# Altium schematic sheet 1_P1.schdoc
size 307 x 218 mm; Symbol: Drawing-Symbol_A4; Device: Drawing-Symbol_A4; Company: 嘉立创EDA; Version: V1.0; Page Size: A4; @Project Name: 25国赛; @Page Count: 1; @Update Date: 2025-08-02; @Create Date: 2025-07-29; @Schematic Name: Schematic1; @Page No: 1; @Page Name: P1; @Create Time: 21:32:43; @Update Time: 02:34:49; Width: 1170; Height: 825; Region Start: 1; X Region Count: 6; Y Region Count: 4; Blade Width: 10; Title Block Position: 3; @Board Name: 滤波器
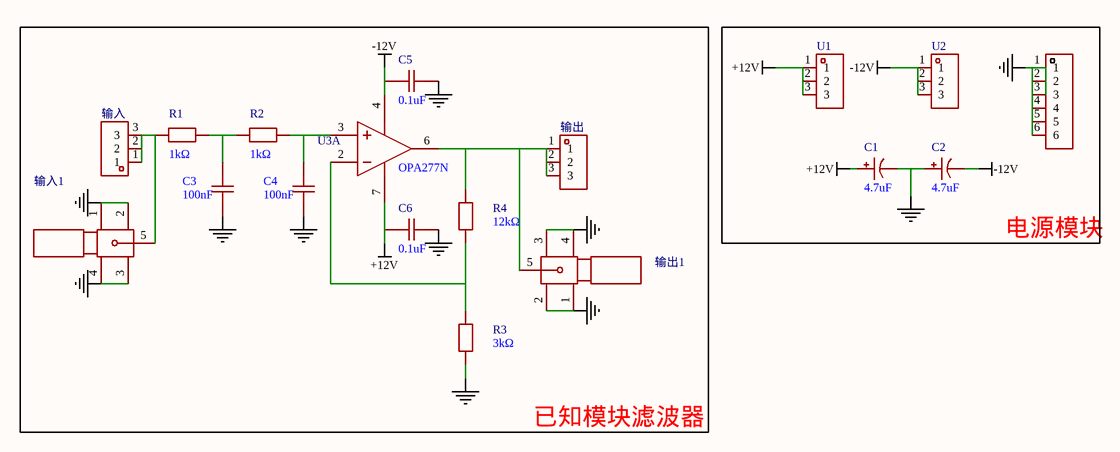
[diagram p0: 1_P1.schdoc]

## Parts
C1  4.7uF  [C0805]
C2  4.7uF  [C0805]
C3  100nF  [C0805]
C4  100nF  [C0805]
C5  0.1uF  [C0805]
C6  0.1uF  [C0805]
H6  PZ254V-11-06P  [HDR-TH_6P-P2.54-V-M]  (value not drawn)
R1  1kΩ  [R0805]
R2  1kΩ  [R0805]
R3  3kΩ  [R0805]
R4  12kΩ  [R0805]
U1  PZ254V-11-03P  [HDR-TH_3P-P2.54-V-M]  (value not drawn)
U2  PZ254V-11-03P  [HDR-TH_3P-P2.54-V-M]  (value not drawn)
U3  OPA277N  [PDIP-8_L9.6-W6.4-P2.54-LS7.6-BL]  (part A of 2)
输入  PZ254V-11-03P  [HDR-TH_3P-P2.54-V-M]  (value not drawn)
输入1  BWSMA-KWE-Z001  [SMA-TH_BWSMA-KWE-Z001]  (value not drawn)
输出  PZ254V-11-03P  [HDR-TH_3P-P2.54-V-M]  (value not drawn)
输出1  BWSMA-KWE-Z001  [SMA-TH_BWSMA-KWE-Z001]  (value not drawn)

## Blocks framed on the sheet
已知模块滤波器: C3-C6 R1-R4 U3 输入 输入1 输出 输出1
电源模块: C1 C2 H6 U1 U2

## Nets
+12V: C1.1 C6.2 U1.1 U1.2 U1.3 U3.7(V+)
-12V: C2.2 C5.2 U2.1 U2.2 U2.3 U3.4(V-)
GND: C1.2 C2.1 C3.1 C4.1 C5.1 C6.1 H6.1 H6.2 H6.3 H6.4 H6.5 H6.6 R3.2 输入1.1 输入1.2 输入1.3 输入1.4 输出1.1 输出1.2 输出1.3 输出1.4
NetC3_2: C3.2 R1.1 R2.2
NetC4_2: C4.2 R2.1 U3.3(IN+)
NetR1_2: R1.2 输入.1 输入.2 输入.3 输入1.5
NetR3_1: R3.1 R4.2 U3.2(IN-)
NetR4_1: R4.1 U3.6(OUT) 输出.1 输出.2 输出.3 输出1.5

## Notes on the sheet
- 1
- 2
- 3
- 4
- 5
- 6
- A
- B
- C
- 原理图
- Schematic1
- 创建日期
- 更新日期
- 2025-07-29
- 2025-08-02
- 板子
- 绘制
- 滤波器
- 图页
- P1
- D
- 审阅
- 版本
- 尺寸
- 25国赛
- 页    1    共    1
- V1.0
- A4
- 嘉立创EDA

## Library data of the parts
C1 C2 = ERS1HM4R7D11OT: Manufacturer: AISHI(艾华集团); Add into BOM: yes; Tolerance: ±20%; Rated Voltage: 50V; φD: 5mm; L: 11mm; Lifetime @ Temp: 5000hrs@105℃; Symbol: ERS1HM4R7D11OT; Device: ERS1HM4R7D11OT; Supplier: LCSC; Manufacturer Part: ERS1HM4R7D11OT; Value: 4.7uF; Supplier Part: C112512; JLCPCB Part Class: 扩展库; LCSC Part Name: 4.7uF ±20% 50V; Supplier Footprint: 插件,D5xL11mm; Datasheet: https://atta.szlcsc.com/upload/public/pdf/source/20191015/C438940_4B8E60A742BB0AE40DDEF87A5C89089D.pdf; Convert to PCB: yes; Lead Spacing: 2mm
C3 C4 = CAP_0603: Symbol: Capacitance; Convert to PCB: yes; Device: CAP_0603; Add into BOM: yes; Supplier Footprint: 0603; Value: 100nF
C5 C6 = R08B1B102KN0B0S0N0: Manufacturer: STE(松田); Add into BOM: yes; Tolerance: ±10%; Voltage Rated: 2kV; Temperature Coefficient: Y5P; φD: 8mm; Body Thickness: 3mm; Symbol: R08B1B102KN0B0S0N0; Device: R08B1B102KN0B0S0N0; LCSC Part Name: 1nF ±10% 2kV; Manufacturer Part: R08B1B102KN0B0S0N0; Supplier Footprint: 插件,P=5mm; JLCPCB Part Class: 扩展库; Datasheet: https://atta.szlcsc.com/upload/public/pdf/source/20190806/C366874_7FA13009B587FE73099181E533DD7411.pdf; Supplier: LCSC; Convert to PCB: yes; Value: 0.1uF; Lead Spacing: 5mm
H6 = PZ254V-11-06P: Manufacturer: XFCN(兴飞); Add into BOM: yes; Pin Structure: 1x6P; Pitch: 2.54mm; Circluar Pins/Square Pins: 方针; Symbol: PZ254V-11-06P; Device: PZ254V-11-06P; LCSC Part Name: 1x6P 间距:2.54mm 方针 直插; Supplier Part: C492405; Manufacturer Part: PZ254V-11-06P; Supplier Footprint: 插件,P=2.54mm; JLCPCB Part Class: 扩展库; Datasheet: https://atta.szlcsc.com/upload/public/pdf/source/20200309/C492405_597F1930F5B55CC3C7FD95458F1C3977.pdf; Supplier: LCSC; Convert to PCB: yes; Row Spacing: -; Mounting Type: 直插; Number of Rows: 单排; Number of Pins: 6P; Current Rating: -; Voltage Rating (Max): -; Length of Mating Pin: 6mm; Insulation Height: 2.5mm; Length of End Connection Pin: 3mm; Contact Material: 黄铜; Contact Plating: -; Operating Temperature: -40℃~+105℃; Color: 黑色
R1-R4 = MF1/4W-1K±1%-ST52: Manufacturer: VO(翔胜); Add into BOM: yes; Tolerance: ±1%; Overload Voltage (Max): 250V; Power(Watts): 250mW; Temperature Coefficient: ±100ppm/℃; Symbol: MF1/4W-1K±1%-ST52; Device: MF1/4W-1K±1%-ST52; LCSC Part Name: 金属膜电阻 1kΩ ±1% 250mW; Manufacturer Part: MF1/4W-1K±1%-ST52; Supplier Footprint: 插件,D2.7xL6.2mm; JLCPCB Part Class: 扩展库; Datasheet: https://atta.szlcsc.com/upload/public/pdf/source/20200609/C601728_5AA4C0C8E12E11069DA2C3356F29D1F2.pdf; Supplier: LCSC; Convert to PCB: yes; Type: 金属膜电阻; Operating Temperature Range: -55℃~+155℃
  R1 R2: Value: 1kΩ
  R3: Value: 3kΩ
  R4: Value: 12kΩ
U1 U2 输入 输出 = PZ254V-11-03P: Manufacturer: XFCN(兴飞); Symbol: PZ254V-11-03P_C2937625; Add into BOM: yes; Pin Structure: 1x3P; Pitch: 2.54mm; Circluar Pins/Square Pins: 方针; Current Rating (Max): 3A; Voltage Rating (Max): 250V; Device: PZ254V-11-03P; LCSC Part Name: 间距:2.54mm 1x3P 直插 方针; Supplier Part: C2937625; Manufacturer Part: PZ254V-11-03P; Supplier Footprint: 插件,P=2.54mm; JLCPCB Part Class: 扩展库; Datasheet: https://atta.szlcsc.com/upload/public/pdf/source/20200309/C492402_8335C3D49C4E4C618838D59BB1D024C1.pdf; Supplier: LCSC; Convert to PCB: yes; Row Spacing: -; Mounting Type: 直插; Number of Rows: 单排; Number of Pins: 3P; Length of Mating Pin: 6mm; Insulation Height: 2.5mm; Length of End Connection Pin: 3mm; Operating Temperature Range: -40℃~+105℃; Color: 黑色
U3 = OPA277N: Manufacturer: HGSEMI(华冠); Add into BOM: yes; Number of Channels: 双路; Maximum Power Supply Range (Vdd-Vss): 32V; Vos - Input Offset Voltage: 100uV; Input Offset Voltage Drift(Vos TC): 1.5uV/℃; Slew Rate: 800V/ms; Ib - Input Bias Current: 2.8nA; Noise density(eN): 8nV/√Hz@1kHz; Common Mode Rejection Ratio(CMRR): 140dB; Dual Supply: 2V~16V；-16V~-2V; Relevance: []; Symbol: OPA277N; Device: OPA277N; LCSC Part Name: OPA277N; Supplier Part: C41415956; Manufacturer Part: OPA277N; Supplier Footprint: DIP-8; Datasheet: https://atta.szlcsc.com/upload/public/pdf/source/20240925/E5EB8F32226A58907444168DD1FEB186.pdf; Supplier: LCSC; Convert to PCB: yes; Rail to Rail: -; Gain Bandwidth Product: -; Input Offset Current(Ios): -; Input offset current drift(Ios TC): -; Quiescent Current: -; Output Current: -; Operating Temperature: -20℃~+85℃; Single supply: -
输入1 输出1 = BWSMA-KWE-Z001: Manufacturer: BAT WIRELESS(蝙蝠无线); Add into BOM: yes; Connector Type: 板端; Interface Type: 内孔; Number of Ports: 1; Interface Diameter: 5.3mm; RF Series: SMA; Impedance: 50Ω; Style: 弯头; Symbol: BWSMA-KWE-Z001; Device: BWSMA-KWE-Z001; LCSC Part Name: 内孔 SMA 弯头; Supplier Part: C496551; Manufacturer Part: BWSMA-KWE-Z001; Supplier Footprint: 插件; JLCPCB Part Class: 扩展库; Datasheet: https://atta.szlcsc.com/upload/public/pdf/source/20231017/997A8C2ADA7F8034A89BE1264F38CE52.pdf; Supplier: LCSC; Convert to PCB: yes; Interface Length/Height: -; Frequency-Max: -; Contact Material: -; Contact Plating: -; Operating Temperature Range: -; Soldering Temperature(Max): -